# Altium schematic sheet LCD.SchDoc: LCD interface
size A4; Engineer: CT; SheetNumber: 3; SheetTotal: 5
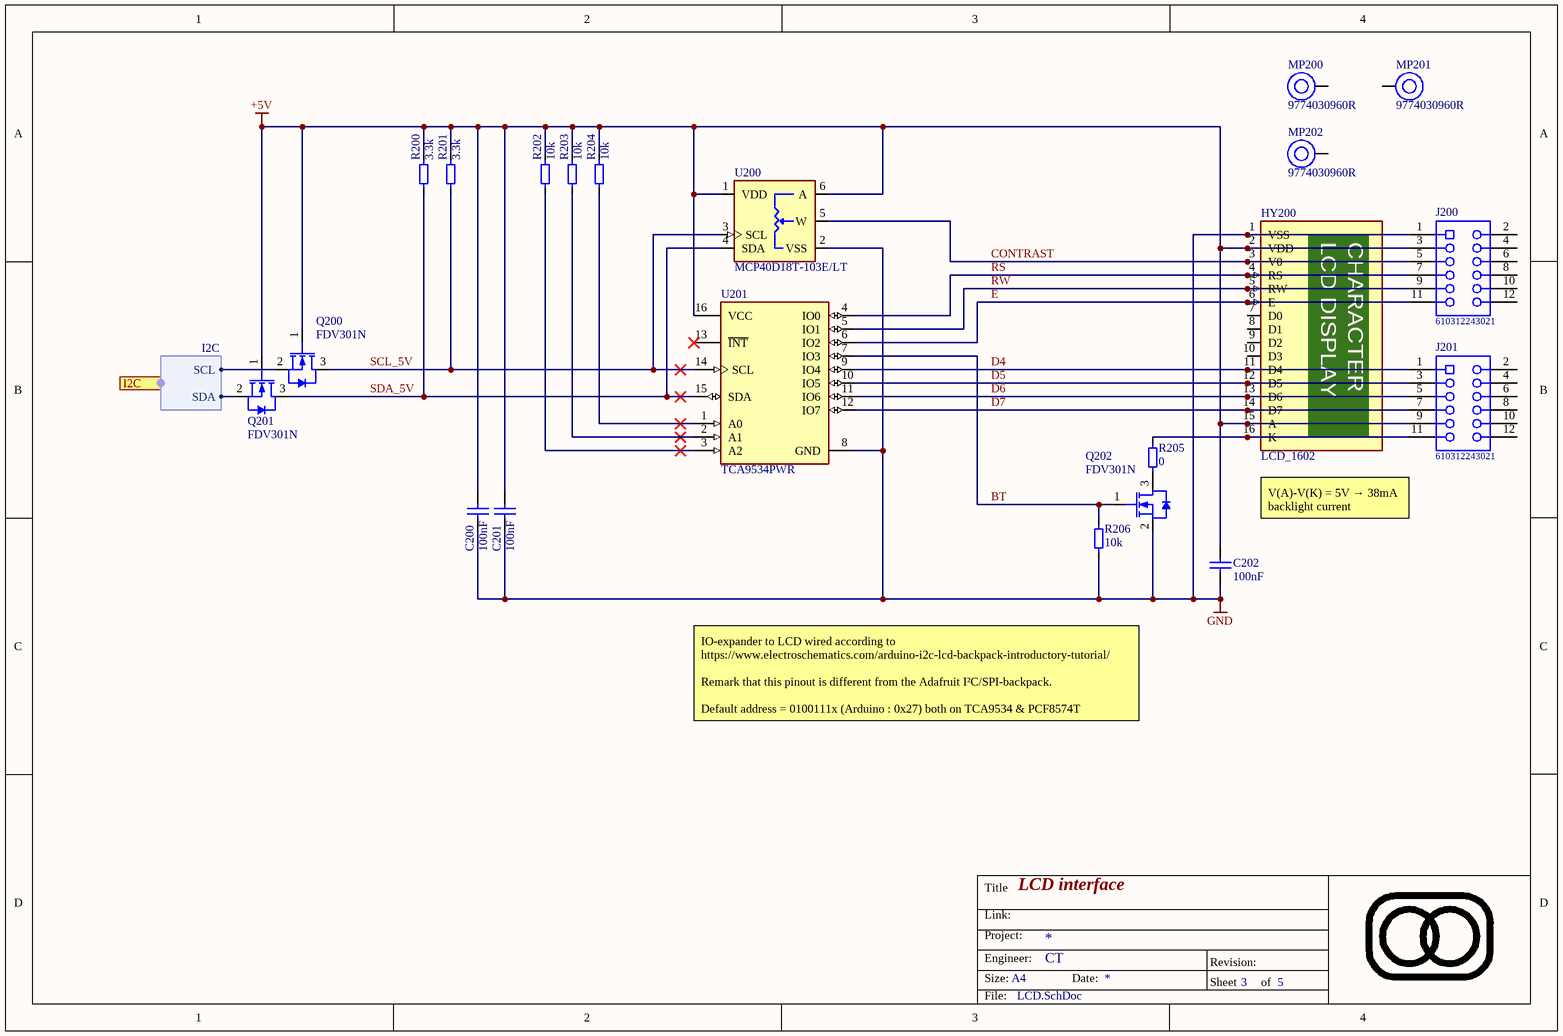
[diagram p0: LCD.SchDoc]

## Parts
C200  value 100nF  [0603-C-N]  (hidden comment: Capacitor 100nF +/-10% 10V X7R 0603)
C201  value 100nF  [0603-C-N]  (hidden comment: Capacitor 100nF +/-10% 10V X7R 0603)
C202  value 100nF  [0603-C-N]  (hidden comment: Capacitor 100nF +/-10% 10V X7R 0603)
HY200  LCD_1602  [LCD_1602-BottomEntry]
J200  610312243021  [610312243021]
J201  610312243021  [610312243021]
MP200  9774030960R  [9774030960]
MP201  9774030960R  [9774030960]
MP202  9774030960R  [9774030960]
Q200  FDV301N  [SOT-23-3-N]
Q201  FDV301N  [SOT-23-3-N]
Q202  FDV301N  [SOT-23-3-N]
R200  value 3.3k  [0603-R-N]  (hidden comment: Resistor 3.3k +/-1% 75V 0603)
R201  value 3.3k  [0603-R-N]  (hidden comment: Resistor 3.3k +/-1% 75V 0603)
R202  value 10k  [0603-R-N]  (hidden comment: Resistor 10k +/-0.05% 75V 0603)
R203  value 10k  [0603-R-N]  (hidden comment: Resistor 10k +/-0.05% 75V 0603)
R204  value 10k  [0603-R-N]  (hidden comment: Resistor 10k +/-0.05% 75V 0603)
R205  value 0  [1206-R-N]  (hidden comment: Jumper 0R <50 mOhm 2A 1206)
R206  value 10k  [0603-R-N]  (hidden comment: Resistor 10k +/-0.05% 75V 0603)
U200  MCP40D18T-103E/LT  [SOT363-N]
U201  TCA9534PWR  [TSSOP16-0.65-4.4-L]

## Ports
I2C (harness I2C)

## Harnesses
I2C: SCL, SDA

## Nets
+5V: C200.2 C201.2 C202.2 HY200.2(VDD) HY200.15(A) J200.3 J201.9 Q200.1(G) Q201.1(G) R200.2 R201.2 R202.2 R203.2 R204.2 U200.1(VDD) U200.6(A) U201.16(VCC)
GND: C200.1 C201.1 C202.1 HY200.1(VSS) J200.1 Q202.2(S) R206.1 U200.2(VSS) U201.8(GND)
BT: Q202.1(G) R206.2 U201.7(IO3)
CONTRAST: HY200.3(V0) J200.5 U200.5(W)
D4: HY200.11(D4) J201.1 U201.9(IO4)
D5: HY200.12(D5) J201.3 U201.10(IO5)
D6: HY200.13(D6) J201.5 U201.11(IO6)
D7: HY200.14(D7) J201.7 U201.12(IO7)
E: HY200.6(E) J200.11 U201.6(IO2)
RS: HY200.4(RS) J200.7 U201.4(IO0)
RW: HY200.5(RW) J200.9 U201.5(IO1)
SCL_5V: Q200.3(D) R201.1 U200.3(SCL) U201.14(SCL)
SDA_5V: Q201.3(D) R200.1 U200.4(SDA) U201.15(SDA)
NetHY200_16: HY200.16(K) J201.11 R205.2
NetQ200_2: Q200.2(S) ; port I2C.SCL
NetQ201_2: Q201.2(S) ; port I2C.SDA
NetQ202_3: Q202.3(D) R205.1
NetR202_1: R202.1 U201.3(A2)
NetR203_1: R203.1 U201.2(A1)
NetR204_1: R204.1 U201.1(A0)

Not connected (* = marked no-connect by the designer): HY200 7(D0) 8(D1) 9(D2) 10(D3); J200 2 4 6 8 10 12; J201 2 4 6 8 10 12; MP200 1; MP201 1; MP202 1; U201 13(~{INT})*

## Notes on the sheet
- V(A)-V(K) = 5V → 38mA backlight current
- IO-expander to LCD wired according to https://www.electroschematics.com/arduino-i2c-lcd-backpack-introductory-tutorial/
  Remark that this pinout is different from the Adafruit I²C/SPI-backpack.
  Default address = 0100111x (Arduino : 0x27) both on TCA9534 & PCF8574T
- Title
- Link:
- Size:
- Project:
- Engineer:
- A4
- Date:
- Revision:
- Sheet
- of
- File:
- (in symbol CMP-000004-14) LCD DISPLAY; CHARACTER

## Library data of the parts
C200-C202 = CMP-072-000541-10: WCAP-CSGP Multilayer Ceramic Chip Capacitor, General Purpose, size 0603, X7R, 100nF, 10VDC; Dissipation Factor: 5%; Capacitor Type: MLCC; Tolerance: 10%; Technical Reference: X7R0603104K010DFCT10000; Insulation Resistance: 5GO; Voltage Rating: 10V; Min Operating Temperature: -55°C; Design Item ID: 885012206020; ComponentLink1URL: https://www.we-online.com/redexpert/article/885012206020?ad; Width: 0.8mm; ComponentLink2URL: https://www.we-online.com/redexpert/spec/885012206020?ad; Mounting Technology: SMT; Pins: 2; Height: 0.8mm; Dielectric: X7R; Packaging: Tape and Reel; ComponentLink1Description: Website Link; Match Code: WCAP-CSGP; ComponentLink2Description: Datasheet Link; Length: 1.6mm; Usage: General Purpose; Max Operating Temperature: 125°C; Case/Package: 0603; Source: WCAP-CSGP.SchLib
HY200 = CMP-000004-14: 2x16 character LCD display
J200 J201 = CMP-045-000113-1: WR-PHD Socket Header, SMT, pitch 2.54mm, Dual Row, Vertical, 12p; Manufacturer: Wurth Elektronik; Pin Number: 12; Rated Current: 3A; Working Voltage: 250VAC; Withstanding Voltage: 500VAC; Contact Resistance: 20mOhm; Gender: Socket Header; Orientation: Vertical; ComponentLink2Description: Datasheet; Operating Temperature: -40 to +125degC; Pitch: 2.54mm; Row Number: Dual; Source: WR-PHD_Socket Header.SchLib; Manufacturer Part Number: 610312243021; Packaging: Tape and Reel; ComponentLink1URL: http://www.we-online.de; Component Type: Standard; Mounting Technology: SMT; ComponentLink2URL: https://www.we-online.com/catalog/datasheet/610312243021.pdf; Pin Count: 12; Design Item ID: 610312243021; ComponentLink1Description: Manufacturer
MP200-MP202 = CMP-002-001388-1: WA-SMST SMT Steel Spacer, OD 6mm, hole 3.3mm x 3mm; Manufacturer: Wurth Elektronik; Surface: Tin; Material: Steel; Inside Diameter: 3.3mm; Design Item ID: 9774030960R; Manufacturer Part Number: 9774030960R; Operating Temperature Min: -55°C; ComponentLink1URL: https://www.we-online.com/redexpert/article/9774030960R?ad; Packaging: Tape and Reel; Operating Temperature Max: 150°C; Component Type: Standard; ComponentLink2URL: https://www.we-online.com/redexpert/spec/9774030960R?ad; Pin Count: 1; Height: 3mm; ComponentLink1Description: Website Link; Mount: Surface Mount; Match Code: WA-SMST; ComponentLink2Description: Datasheet Link; Category: SMT Spacers; Source: WA-SMST.SchLib; Outside Diameter: 6mm
Q200-Q202 = CMP-013-00055-4: Transistor MOSFET N-Ch. 25V 220mA 0, 35W 4Ohm SOT23; Number of Channels: 1; Rise Time: 6ns; Rds On Max: 4R; Vgs (Max): 8V; Max Power Dissipation: 350mW; Input Capacitance: 9.5pF; Polarity: N-CHANNEL; Drain to Source Resistance: 5R; Vgs(th) (Max) @ Id: 1.06V @250µA; Transistor Type: NMOS; Turn-Off Delay Time: 3.5ns; Turn-On Delay Time: 3.2ns; Packaging: Tape and Reel; Series: -; Length: 2.9mm; Weight: 0.001093oz; Continuous Drain Current (ID): 220mA; Width: 1.3mm; Vds Max: 25V; Height: 1.2mm; Mounting Technology: Surface Mount; Gate to Source Voltage (Vgs): 8V; Min Operating Temperature: -55°C; Case/Package: SOT-23-3; Fall Time: 6ns; Id - Continuous Drain Current: 220mA; Pins: 3; Drain to Source Voltage (Vdss): 25V; Max Operating Temperature: 150°C; Package Quantity: 3000
R200 R201 = CMP-009-00243-9: Chip Resistor, Thick Film, General Purpose, 0603, 100mW, 75V, 3.3 kOhm, +/-1%; Tolerance: 1%; Elements: 1; Resistor Type: Thick Film; RoHS Compliant: Yes; Voltage Rating: 75V; Usage: General Purpose; Case/Package: 0603; Pins: 2; Power Rating: 100mW; Mounting Technology: SMT; Min Operating Temperature: -55°C; JLCPCB Part #: C22978; Max Operating Temperature: 155°C
R202-R204 R206 = CMP-009-00182-14: Chip Resistor, Thin Film, Precision, 0603, 100mW, 75V, 10 kOhm, +/-0.05%; Tolerance: 0.05%; Elements: 1; Temperature Coefficient: 10ppm/°C; Power Rating: 100mW; Mounting Technology: SMT; Usage: Precision; Resistor Type: Thin Film; RoHS Compliant: True; Voltage Rating: 75V; Lead Free: Lead Free; Pins: 2; Min Operating Temperature: -55°C; Case/Package: 0603; Packaging: Tape and Reel; Max Operating Temperature: 155°C; Features: Automotive AEC-Q200
R205 = CMP-009-00002-19: Chip Jumper, Thick Film, Jumper, 1206, 250mW, 2A, 0 Ohm, <50 mOhm; Tolerance: 50 mOhm; Elements: 1; Voltage Rating: 200V; Case/Package: 1206; Max Operating Temperature: 155°C; Power Rating: 250mW; RoHS Compliant: True; Resistor Type: Thick Film; Current Rating: 2A; Pins: 2; Usage: Jumper; Min Operating Temperature: -55°C; Mounting Technology: SMT
U200 = CMP-015-00026-1: Digital Potentiometer 10kOhm 128POS Volatile Linear Automotive 6-Pin SC-70 T/R; Value: 10kR; Tolerance: 20%; Min Supply Voltage: 1.8V; Max Supply Voltage: 5.5V; Number of Circuits: 1; Number of Taps: 128; Interface: I2C,Serial,2-Wire; Nominal Supply Current: 45uA; Temperature Coefficient: 150ppm/°C; Case/Package: SC; Packaging: Tape and Reel; Mounting Technology: Surface Mount; Radiation Hardening: No; Length: 2mm; Pins: 6; Width: 1.25mm; Memory Format: Volatile; Resistance Tolerance: 20%; Min Operating Temperature: -40°C; Number of Positions: 128; Max Operating Temperature: 125°C; RoHS Compliant: Yes; Package Quantity: 3000; Height: 0.9mm; Lead Free: Lead Free; Reach SVHC Compliant: Yes; Supply Current: 45uA; Number of Elements: 1
U201 = CMP-000028-10: 8-bit I/O expander, I2C/SMBus, 400kHz, 1.65 to 5.5V, TSSOP-16; Number of I/Os: 8; Interface: I2C; Output Type: PUSH-PULL; RoHS Compliant: Yes; Mounting Technology: Surface Mount; Lead Free: Lead Free; Series: -; Number of Outputs: 8; Packaging: Cut Tape; Max Operating Temperature: 85°C; Min Operating Temperature: -40°C; Pins: 16; Case/Package: TSSOP; Frequency: 400kHz